# EAGLE design fm_transmit_2 (EAGLE 6.4)
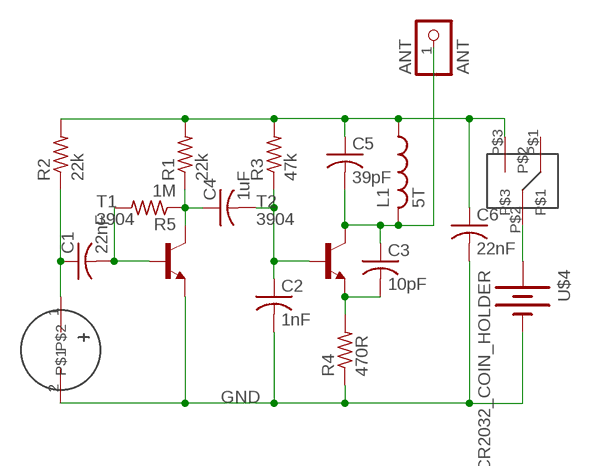
[diagram p0: schematic, sheet 1]

## Parts
ANT  ANT  PINHD-1X1  [1X01]
C1  22nF  C-USC1206  [C1206]
C2  1nF  C-USC1206  [C1206]
C3  10pF  C-USC1206  [C1206]
C4  1uF  C-USC1206  [C1206]
C5  39pF  C-USC1206  [C1206]
C6  22nF  C-USC1206  [C1206]
L1  5T  L-US0207/15  [0207/15]
R1  22k  R-US_R1206  [R1206]
R2  22k  R-US_R1206  [R1206]
R3  47k  R-US_R1206  [R1206]
R4  470R  R-US_R1206  [R1206]
R5  1M  R-US_R1206  [R1206]
T1  3904  MMBT3904LT1-NPN-SOT23-BEC  [SOT23-BEC]
T2  3904  MMBT3904LT1-NPN-SOT23-BEC  [SOT23-BEC]
U$1  SPDT  [SWITCH]
U$2  MIC  [MIC]
U$4  CR2032_COIN_HOLDER  [COIN_HOLDER]

## Nets
+3V: U$1.P$2 U$4.P$1(+) U$4.P$2(+) U$4.P$3(+) U$4.P$4(+)
GND: C2.2 C6.2 R4.1 T1.E U$2.2 U$4.P$5(-)
N$1: C1.2 R5.2 T1.B
N$2: C4.1 R1.1 R5.1 T1.C
N$3: C1.1 R2.1 U$2.1
N$4: C2.1 C4.2 R3.1 T2.B
N$6: ANT.1 C3.1 C5.2 L1.2 T2.C
N$7: C5.1 C6.1 L1.1 R1.2 R2.2 R3.2 U$1.P$3
N$8: C3.2 R4.2 T2.E
Unconnected: U$1.P$1

## Library data of the parts
ANT = pinhead:PINHD-1X1: PIN HEADER
C1-C6 = rcl:C-US: CAPACITOR, American symbol
L1 = rcl:L-US: INDUCTOR, American symbol
R1-R5 = rcl:R-US_: RESISTOR, American symbol
T1 T2 = transistor-neu-to92:*-NPN-: NPN Transistror
U$1 = fm_transmit:SPDT
U$2 = fm_transmit:MIC
U$4 = fm_transmit:CR2032_COIN_HOLDER

## Board
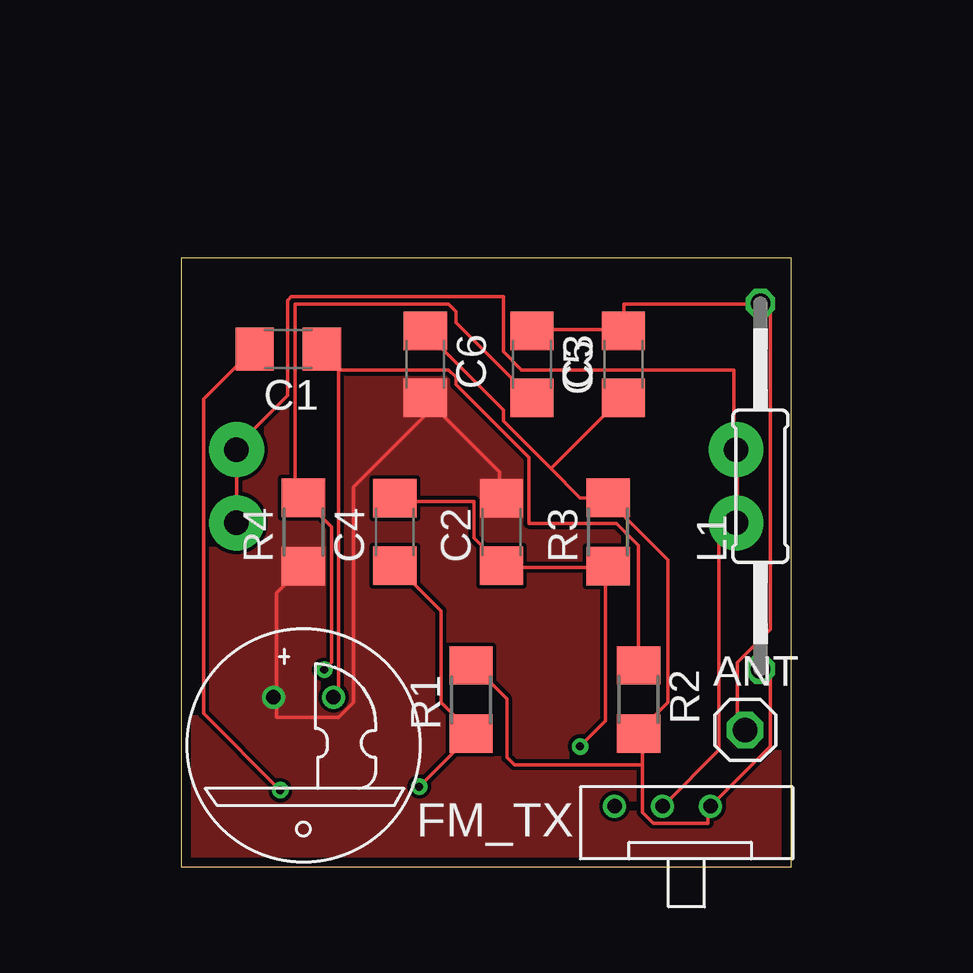
[diagram p1: board, top side]
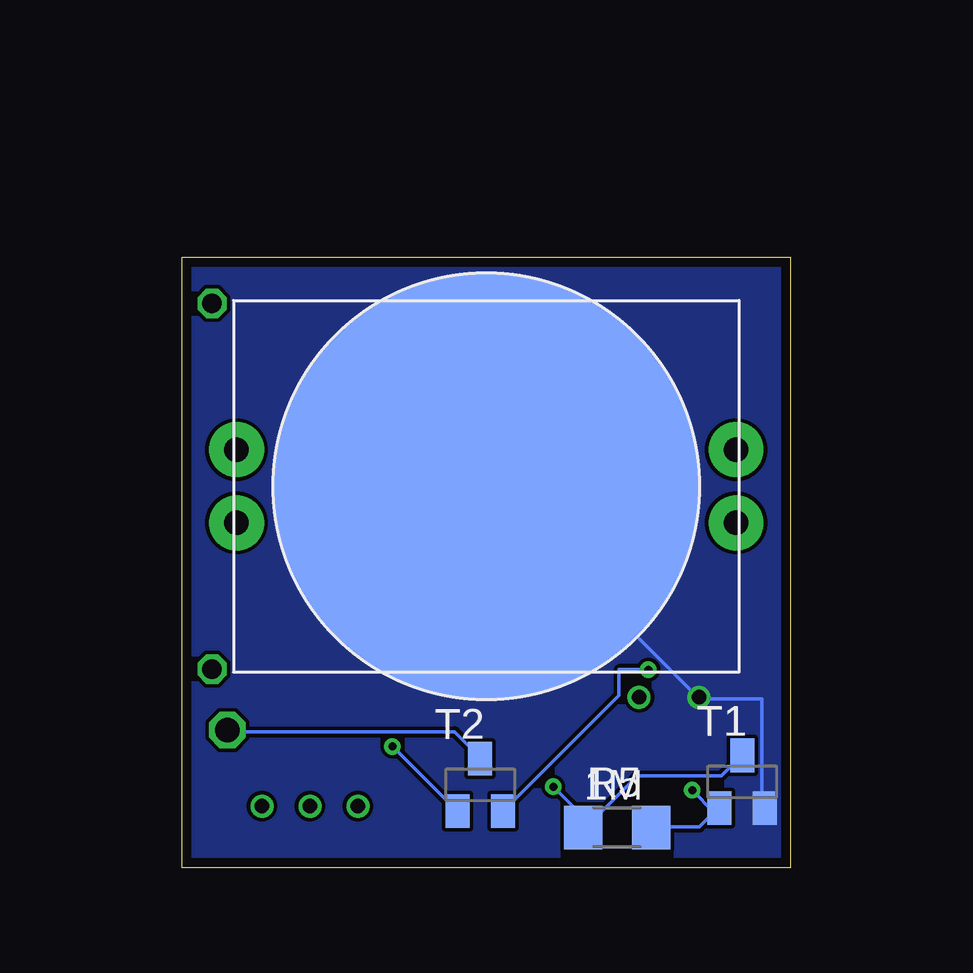
[diagram p2: board, bottom side, seen from below]

Size 25.4 x 25.4 mm. Coordinates in mm from the lower left corner, seen from the top.
Outline: 0,0 0,25.4 25.4,25.4 25.4,0 0,0
Copper layers (1*16): Top 0.0356mm / dielectric 1.5011mm / Bottom 0.0356mm
Design rules "LaenPCBOrder": minimum track width 6mil, minimum drill 13mil, track to track 6mil, track to pad 6mil, pad to pad 6mil, via to via 6mil, smd to smd 6mil, copper to edge 15mil, drill to drill 6mil, minimum pad ring 7mil, minimum via ring 7mil, stop-mask expansion 3mil, vias tented up to drill 0mil, thermal gap 10mil

### Footprints (pad centres in the part's own frame; a part is rotated, then mirrored left to right if it is on the bottom)
1X01 = drill 1.016 octagon: 1 0,0
C1206 = smd 1.6 x 1.8: 1 -1.4,0; 2 1.4,0
0207/15 = drill 0.813 octagon: 1 -7.62,0; 2 7.62,0
R1206 = smd 1.6 x 1.803: 1 -1.422,0; 2 1.422,0
SOT23-BEC = smd 1 x 1.4: B -0.95,-1.1; C 0,1.1; E 0.95,-1.1
SWITCH = drill 0.6: P$1 -1,0; P$2 1,0; P$3 3,0
MIC = drill 0.6: 1 1.25,2; 2 -1.25,2
COIN_HOLDER = drill 1.016 pad 2.286: P$1 10.414,1.524; P$2 10.414,-1.524; P$3 -10.414,1.524; P$4 -10.414,-1.524 | smd 17.78 x 17.78: P$5 0,0

### Placement (x,y rotation side)
ANT  23.5,5.71 0 top
C1  4.45,21.59 180 top
C2  13.34,13.97 90 top
C3  14.61,20.95 270 top
C4  8.89,13.97 90 top
C5  18.41,20.95 90 top
C6  10.16,20.95 270 top
L1  24.13,15.88 90 top
R1  12.06,6.99 90 top
R2  19.05,6.99 270 top
R3  17.78,13.97 90 top
R4  5.08,13.97 90 top
R5  7.24,1.65 0 bottom
T1  2.03,3.56 0 bottom
T2  12.95,3.43 0 bottom
U$1  19.05,2.54 0 top
U$2  5.08,5.08 0 top
U$4  12.7,15.88 0 bottom

### Tracks (layer width: path | path; a pad name or v marks a point on that pad's centre or on a via)
+3V
  Top 0.152: U$4.P$2 U$4.P$1 2.29,17.53 4.42,19.66 4.42,23.62 4.57,23.77 13.41,23.77 13.41,21.49 14.17,20.73 23.01,20.73 23.01,17.53 U$4.P$3 23.16,17.37 23.16,14.48 U$4.P$4 23.01,14.33 22.4,13.72 22.4,4.88 20.12,2.59 U$1.P$2
GND
  Top 0.152: 10.52,19.2 13.26,16.46 13.26,15.39 C2.2 | 10.52,19.2 10.21,19.51 C6.2 10.52,19.2 | R4.1 5.03,12.5 3.96,11.43 3.96,7.16 U$2.2 3.96,7.01 3.96,6.25 6.55,6.25 7.16,6.86 7.16,15.85 10.52,19.2
  Bottom 0.152: T1.E 1.22,2.59 1.22,7.01 3.81,7.01 U$2.2 3.96,7.16 12.65,15.85 U$4.P$5
  pour Top (no thermals): -2.54,27.94 27.94,27.94 27.94,-2.54 -2.54,-2.54
  pour Bottom (no thermals): -2.54,27.94 -2.54,-2.54 27.94,-2.54 27.94,27.94
N$1  (via drill 0.33)
  Top 0.152: v4.12,3.2 0.91,6.4 0.91,19.51 2.9,21.49 C1.2
  Bottom 0.152: 3.2,2.29 3.81,1.68 5.79,1.68 R5.2 | 3.2,2.29 3.05,2.44 T1.B 3.2,2.29 | 3.2,2.29 v4.12,3.2
N$2  (via drill 0.33)
  Top 0.152: C4.1 8.99,12.5 10.82,10.67 10.82,6.86 12.04,5.64 R1.1 12.04,5.49 v9.91,3.35
  Bottom 0.152: 8.38,1.83 8.53,1.68 R5.1 8.38,1.83 | 8.38,1.83 6.4,3.81 2.9,3.81 2.13,4.57 T1.C | v9.91,3.35 8.38,1.83
N$3
  Top 0.152: 6.55,20.73 6.55,7.32 6.4,7.16 U$2.1 | 6.55,20.73 6.55,20.88 5.94,21.49 C1.1 6.55,20.73 | R2.1 19.05,13.41 18.14,14.33 14.48,14.33 14.48,17.07 11.43,20.12 11.43,20.42 11.12,20.73 6.55,20.73
N$4  (via drill 0.33)
  Top 0.152: C4.2 8.99,15.24 12.19,15.24 12.19,13.72 13.26,12.65 C2.1 13.41,12.5 17.68,12.5 | v16.61,5.03 17.68,6.1 17.68,12.5 | 17.68,12.5 R3.1
  Bottom 0.152: v16.61,5.03 14.02,2.44 T2.B
N$6
  Top 0.152: C3.1 14.63,22.4 18.29,22.4 C5.2 18.44,22.4 18.44,23.47 24.08,23.47 L1.2 24.23,23.47 24.54,23.16 24.54,9.91 23.16,8.53 23.16,6.1 23.47,5.79 ANT.1
  Bottom 0.152: T2.C 12.95,4.57 14.02,5.64 23.47,5.64 ANT.1
N$7
  Top 0.152: 15.39,16.61 16.61,15.39 17.68,15.39 R3.2 17.83,15.24 20.27,12.8 20.27,6.86 19.05,5.64 R2.2 19.05,5.49 19.2,5.33 19.2,4.27 | 15.39,16.61 13.41,18.59 13.41,19.05 10.21,22.25 C6.1 | 15.39,16.61 18.29,19.51 C5.1 | 19.2,4.27 19.2,2.29 19.66,1.83 21.95,1.83 21.95,2.44 U$1.P$3 22.1,2.59 24.54,5.03 24.54,7.92 24.23,8.23 L1.1 | 19.2,4.27 13.87,4.27 13.56,4.57 13.56,7.01 12.19,8.38 R1.2
N$8  (via drill 0.33)
  Top 0.152: v5.94,8.23 6.25,8.53 6.25,14.17 5.18,15.24 R4.2 5.03,15.39 4.72,15.7 4.72,23.47 11.12,23.47 11.43,23.16 11.43,22.71 14.48,19.66 C3.2
  Bottom 0.152: v5.94,8.23 7.16,8.23 7.16,7.16 11.89,2.44 T2.E

### Text on the board
tPlace: FM_TX
bPlace: 1M